# Altium schematic sheet Power.schdoc
size 253 x 60 mm
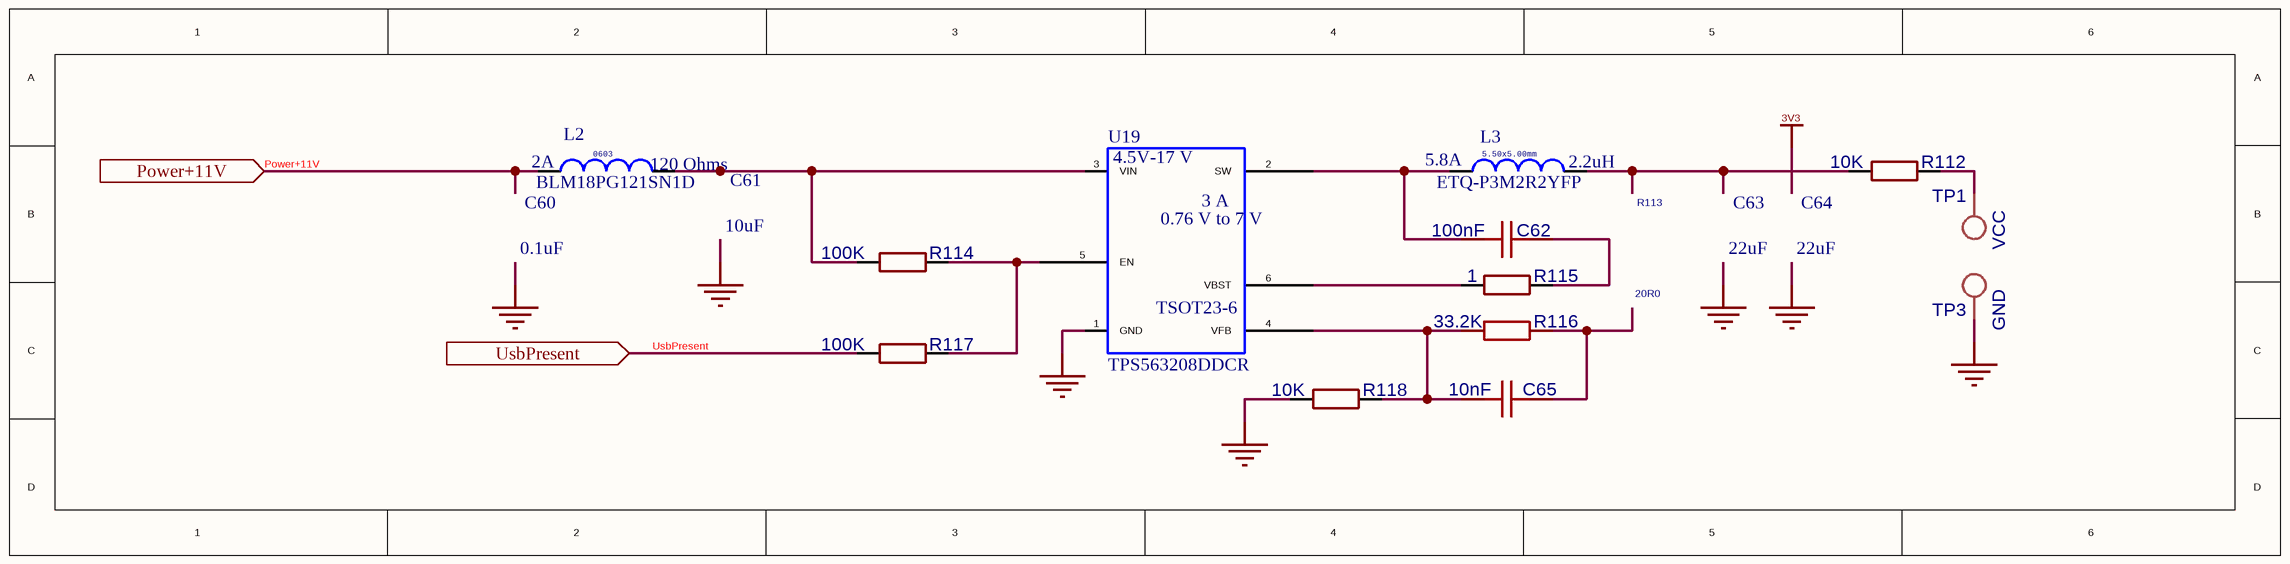
[diagram p0: Power.schdoc]

## Parts
C60  0.1uF  [0402]
C61  10uF  [0603]
C62  100nF  [C0402]
C63  22uF  [0603]
C64  22uF  [0603]
C65  10nF  [C0402]
L2  BLM18PG121SN1D  [L0603]
L3  ETQ-P3M2R2YFP  [ETQ-P3M2R2YFP]
R112  10K  [R0402]
R113  20R0  [0402]
R114  100K  [R0402]
R115  1  [R0402]
R116  33.2K  [R0402]
R117  100K  [R0402]
R118  10K  [R0402]
TP1  VCC  [TESTPOINT_SMT]
TP3  GND  [TESTPOINT_SMT]
U19  TPS563208DDCR  [TSOT-23-6_L2.9-W1.6-P0.95-LS2.8-BL]

## Ports
Power+11V (in), UsbPresent (in)

## Nets
GND: R118.2 TP3.P$1 U19.1(GND)
Power+11V: L2.1 ; port Power+11V
UsbPresent: R117.1 ; port UsbPresent
NetC62_1: C62.1 R115.2
NetC62_2: C62.2 L3.1 U19.2(SW)
NetC65_1: C65.1 R116.2
NetC65_2: C65.2 R116.1 R118.1 U19.4(VFB)
NetL2_2: L2.2 R114.1 U19.3(VIN)
NetL3_2: L3.2 R112.2
NetR112_1: R112.1 TP1.P$1
NetR114_2: R114.2 R117.2 U19.5(EN)
NetR115_1: R115.1 U19.6(VBST)

## Notes on the sheet
- (in symbol BLM18PG121SN1D) 0603
- (in symbol ETQ-P3M2R2YFP) 5.50x5.00mm

## Library data of the parts
C60 = 0.1uF: Part Number: GRM155R71E104KE14D; ALT_SYMBOLS: 0402_RND; MFG: Murata Electronics; NO_XNET_CONNECTION: True; OVPN: OVCC00093; TYPE: X7R; VOLTAGE: 25V; PCBFootPrint: 0402; PCB Footprint: 0402
C61 = 10uF: Part Number: CL10A106MA8NRNC; VOLTAGE: 25V; TYPE: X5R; OVPN: OVCC00088; MFG: Samsung Electro-Mechanics; PCBFootPrint: 0603; PCB Footprint: 0603
C62 = 100nF: BOM_Manufacturer: TDK; BOM_Manufacturer Part: C1005X7R1C104KT000F; nameAlias: Capacitance; Contributor: LCSC; BOM_Supplier: LCSC; BOM_Supplier Part: C338032; spicePre: C; spiceSymbolName: C1005X7R1C104KT000F
C63 C64 = 22uF: Part Number: GRM188C80J226ME15D; MFG: Murata Electronics; OVPN: OVCC00080; TYPE: X6S; VOLTAGE: 6.3V; PCBFootPrint: 0603; PCB Footprint: 0603
C65 = 10nF: BOM_Manufacturer: YAGEO; BOM_Manufacturer Part: CC0402JRX7R9BB103; nameAlias: Capacitance; Contributor: LCSC; BOM_Supplier: LCSC; BOM_Supplier Part: C272878; BOM_JLCPCB Part Class: Extended Part; spicePre: C; spiceSymbolName: CC0402JRX7R9BB103
L2 = BLM18PG121SN1D: NO_XNET_CONNECTION: True; OVPN: OVLF00001; MFG: Murata Electronics; Impedance: 120 Ohms; Current: 2A; PART Number: BLM18PG121SN1D; PCB Footprint: L0603
L3 = ETQ-P3M2R2YFP: Inductance: 2.2uH; Current: 5.8A; MFG: Panasonic Electronic Components; OVPN: OVLP00029; PART NUMBER: ETQ-P3M2R2YFP; PCB Footprint: ETQ-P3M2R2YFP
R112 R118 = 10K: BOM_Manufacturer: UniOhm; BOM_Manufacturer Part: 0402WGF1002TCE; nameAlias: Resistance (Ohms); BOM_Supplier: LCSC; BOM_Supplier Part: C25744; BOM_JLCPCB Part Class: Basic Part; spicePre: R; spiceSymbolName: 0402WGF1002TCE
R113 = 20R0: Part Number: RC0402FR-0720RL; Tolerance: 1%; Power: 1/16W; OVPN: OVRS00055; NO_XNET_CONNECTION: True; MFG: Yageo; MOUNTING: SMT
R114 R117 = 100K: BOM_Manufacturer: YAGEO; BOM_Manufacturer Part: RC0402FR-07100KL; nameAlias: Resistance (Ohms); BOM_Supplier: LCSC; BOM_Supplier Part: C60491; BOM_JLCPCB Part Class: Extended Part; spicePre: R; spiceSymbolName: RC0402FR-07100KL
R115 = 1: BOM_Manufacturer: UniOhm; BOM_Manufacturer Part: 0402WGF100KTCE; nameAlias: Resistance (Ohms); BOM_Supplier: LCSC; BOM_Supplier Part: C25086; BOM_JLCPCB Part Class: Basic Part; spicePre: R; spiceSymbolName: 0402WGF100KTCE
R116 = 33.2K: BOM_Manufacturer: YAGEO; BOM_Manufacturer Part: AC0402FR-0733K2L; nameAlias: Resistance (Ohms); Contributor: LCSC; BOM_Supplier: LCSC; BOM_Supplier Part: C226998; BOM_JLCPCB Part Class: Extended Part; spicePre: R; spiceSymbolName: AC0402FR-0733K2L
TP1 = VCC: Contributor: edwardvh; spicePre: T; spiceSymbolName: TESTPOINT
TP3 = GND: Contributor: edwardvh; spicePre: T; spiceSymbolName: TESTPOINT
U19 = TPS563208DDCR: Current: 3 A; MFG: Texas Instruments; OUT_VOLTAGE: 0.76 V to 7 V; OVPN: OVIC00130; PcbFootprint: TSOT23-6; VOLTAGE: 4.5V-17 V; PCB Footprint: TSOT23-6_TPS563208DDCR; PART NUMBER: TPS563208DDCR